# Altium schematic sheet Logic.SchDoc
size A4
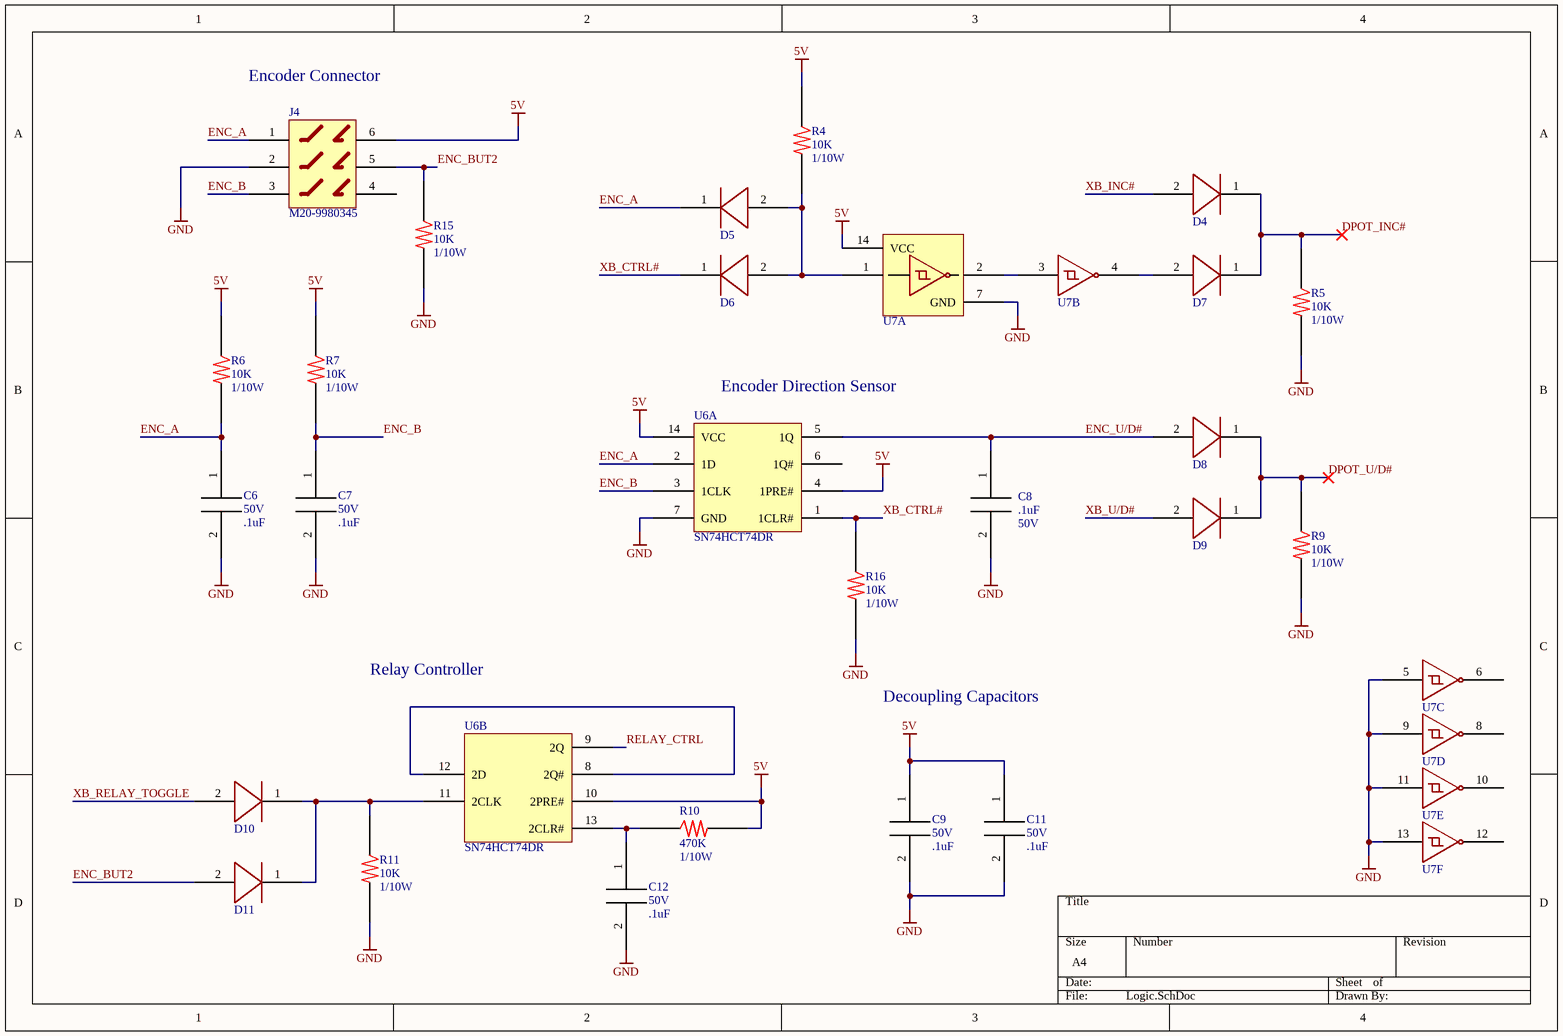
[diagram p0: Logic.SchDoc]

## Parts
C6  value .1uF  Rating: 50V  [0603]  (hidden comment: C_CAP_0603)
C7  value .1uF  Rating: 50V  [0603]  (hidden comment: C_CAP_0603)
C8  value .1uF  Rating: 50V  [0603]  (hidden comment: C_CAP_0603)
C9  value .1uF  Rating: 50V  [0603]  (hidden comment: C_CAP_0603)
C11  value .1uF  Rating: 50V  [0603]  (hidden comment: C_CAP_0603)
C12  value .1uF  Rating: 50V  [0603]  (hidden comment: C_CAP_0603)
D4  D_DIODE_SOD123  [SOD123]  (value not drawn)
D5  D_DIODE_SOD123  [SOD123]  (value not drawn)
D6  D_DIODE_SOD123  [SOD123]  (value not drawn)
D7  D_DIODE_SOD123  [SOD123]  (value not drawn)
D8  D_DIODE_SOD123  [SOD123]  (value not drawn)
D9  D_DIODE_SOD123  [SOD123]  (value not drawn)
D10  D_DIODE_SOD123  [SOD123]  (value not drawn)
D11  D_DIODE_SOD123  [SOD123]  (value not drawn)
J4  J_6POSM_M20-9980345  [M20-9980345]  (value not drawn)
R4  value 10K  Rating: 1/10W  [0603]  (hidden comment: R_RES_0603)
R5  value 10K  Rating: 1/10W  [0603]  (hidden comment: R_RES_0603)
R6  value 10K  Rating: 1/10W  [0603]  (hidden comment: R_RES_0603)
R7  value 10K  Rating: 1/10W  [0603]  (hidden comment: R_RES_0603)
R9  value 10K  Rating: 1/10W  [0603]  (hidden comment: R_RES_0603)
R10  value 470K  Rating: 1/10W  [0603]  (hidden comment: R_RES_0603)
R11  value 10K  Rating: 1/10W  [0603]  (hidden comment: R_RES_0603)
R15  value 10K  Rating: 1/10W  [0603]  (hidden comment: R_RES_0603)
R16  value 10K  Rating: 1/10W  [0603]  (hidden comment: R_RES_0603)
U6  PartNumber: SN74HCT74DR  [SOIC14]  (hidden comment: U_DUALDFLIP_SOIC14)  (parts A,B of 2)
U7  U_SN74HCT04DR_SOIC14  [SOIC14]  (value not drawn)  (parts A,B,C,D,E,F of 6)

## Nets
5V: C9.1 C11.1 J4.6 R4.1 R6.1 R7.1 R10.2 U6.4(1PRE#) U6.10(2PRE#) U6.14(VCC) U7.14(VCC)
GND: C6.2 C7.2 C8.2 C9.2 C11.2 C12.2 J4.2 R5.2 R9.2 R11.2 R15.2 R16.2 U6.7(GND) U7.5 U7.7(GND) U7.9 U7.11 U7.13
DPOT_INC#: D4.1 D7.1 R5.1
DPOT_U/D#: D8.1 D9.1 R9.1
ENC_A: C6.1 D5.1 J4.1 R6.2 U6.2(1D)
ENC_B: C7.1 J4.3 R7.2 U6.3(1CLK)
ENC_BUT2: D11.2 J4.5 R15.1
ENC_U/D#: C8.1 D8.2 U6.5(1Q)
RELAY_CTRL: U6.9(2Q)
XB_CTRL#: D6.1 R16.1 U6.1(1CLR#)
XB_INC#: D4.2
XB_RELAY_TOGGLE: D10.2
XB_U/D#: D9.2
NetC12_1: C12.1 R10.1 U6.13(2CLR#)
NetD5_2: D5.2 D6.2 R4.2 U7.1
NetD7_2: D7.2 U7.4
NetD10_1: D10.1 D11.1 R11.1 U6.11(2CLK)
NetU6_8: U6.8(2Q#) U6.12(2D)
NetU7_2: U7.2 U7.3

Not connected (* = marked no-connect by the designer): J4 4; U6 6(1Q#); U7 6 8 10 12

## Notes on the sheet
- Encoder Connector
- (near U6) Encoder Direction Sensor
- Relay Controller
- Decoupling Capacitors

## Library data of the parts
C6-C9 C11 C12 = C_CAP_0603: PartNumber: C0603C104K5RACAUTO; Manufacturer: KEMET
D4-D11 = D_DIODE_SOD123: PartNumber: BAS16GWJ; Manufacturer: Nexperia USA Inc; Rating: 215mA
J4 = J_6POSM_M20-9980345: Manufacturer: Harwin; Rating: 3A; PartNumber: M20-9980345
R4-R7 R9 R11 R15 R16 = R_RES_0603: PartNumber: RC0603JR-0710KL
R10 = R_RES_0603: PartNumber: RC0603JR-07470KL; Manufacturer: Yageo
U6 = U_DUALDFLIP_SOIC14: Manufacturer: TI
U7 = U_SN74HCT04DR_SOIC14: Manufacturer: TI; PartNumber: SN74HCT04DR